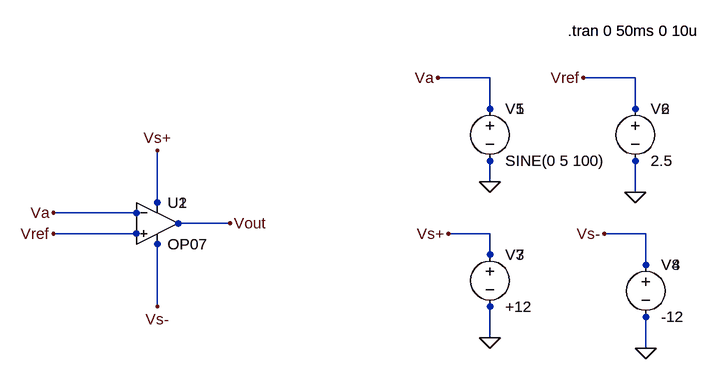
[diagram p0: schematic Draft2.asc]
Draft2.asc, the LTspice schematic file:
Version 4
SHEET 1 1096 680
WIRE 752 -80 672 -80
WIRE 976 -80 896 -80
WIRE 752 -32 752 -80
WIRE 976 -32 976 -80
WIRE 752 80 752 48
WIRE 976 96 976 48
WIRE 240 112 240 32
WIRE 208 128 80 128
WIRE 352 144 272 144
WIRE 208 160 80 160
WIRE 752 160 688 160
WIRE 992 160 928 160
WIRE 752 192 752 160
WIRE 992 208 992 160
WIRE 240 272 240 176
WIRE 752 320 752 272
WIRE 992 336 992 288
FLAG 672 -80 Va
FLAG 896 -80 Vref
FLAG 688 160 Vs+
FLAG 928 160 Vs-
FLAG 752 80 0
FLAG 976 96 0
FLAG 752 320 0
FLAG 992 336 0
FLAG 80 128 Va
FLAG 80 160 Vref
FLAG 240 32 Vs+
FLAG 240 272 Vs-
FLAG 352 144 Vout
SYMBOL voltage 752 -48 R0
WINDOW 123 0 0 Left 0
WINDOW 39 0 0 Left 0
SYMATTR InstName V1
SYMATTR Value SINE(0 5 100)
SYMBOL voltage 976 -48 R0
SYMATTR InstName V2
SYMATTR Value 2.5
SYMBOL voltage 752 176 R0
SYMATTR InstName V3
SYMATTR Value +12
SYMBOL voltage 992 192 R0
SYMATTR InstName V4
SYMATTR Value -12
SYMBOL OpAmps\\OP07 240 80 R0
SYMATTR InstName U1
SYMBOL voltage 752 -48 R0
WINDOW 123 0 0 Left 0
WINDOW 39 0 0 Left 0
SYMATTR InstName V5
SYMATTR Value SINE(0 5 100)
SYMBOL voltage 976 -48 R0
SYMATTR InstName V6
SYMATTR Value 2.5
SYMBOL voltage 752 176 R0
SYMATTR InstName V7
SYMATTR Value +12
SYMBOL voltage 992 192 R0
SYMATTR InstName V8
SYMATTR Value -12
SYMBOL OpAmps\\OP07 240 80 R0
SYMATTR InstName U2
TEXT 872 -152 Left 2 !.tran 0 50ms 0 10u
TEXT 872 -152 Left 2 !.tran 0 50ms 0 10u

The netlist it stands for:
* Draft2.asc
V1 Va 0 SINE(0 5 100)
V2 Vref 0 2.5
V3 Vs+ 0 +12
V4 Vs- 0 -12
XU1 Vref Va Vs+ Vs- Vout LT1001  ; OP07, pins In+ In- V+ V- OUT
V5 Va 0 SINE(0 5 100)
V6 Vref 0 2.5
V7 Vs+ 0 +12
V8 Vs- 0 -12
XU2 Vref Va Vs+ Vs- Vout LT1001  ; OP07, pins In+ In- V+ V- OUT
.tran 0 50ms 0 10u
.tran 0 50ms 0 10u
.lib LTC.lib
.backanno
.end

* Results of the author's LTspice run, read from the files saved beside the schematic
* Operating Point, zero values left out:
*   V(vref) = 2.5 V
*   V(vs+) = 12 V
*   V(vs-) = -12 V
*   V(vout) = 11.07 V
*   I(V4) = 2.254 mA
*   I(V3) = -2.247 mA
*   I(V2) = -869.6 µA
*   I(V1) = 869.6 µA
*   Ix(u1:1) = 869.6 µA
*   Ix(u1:2) = -869.6 µA
*   Ix(u1:3) = 2.247 mA
*   Ix(u1:4) = -2.254 mA
*   Ix(u1:5) = -22.14 pA
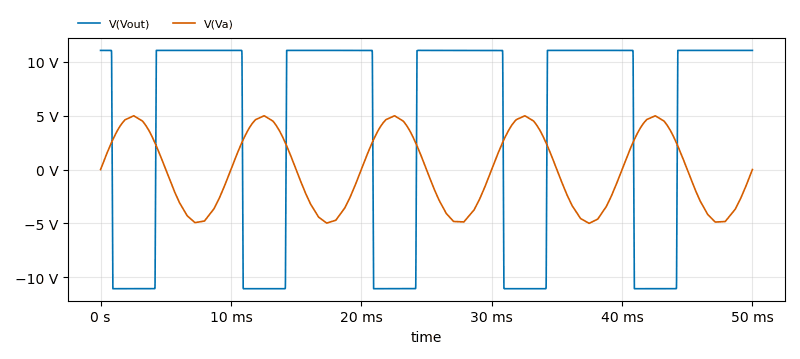
[diagram p1: Transient Analysis of Draft2.asc, plotted from the saved traces]
* Transient Analysis, 1 run:
*   V(Vout): min -11.08 V, max 11.08 V, average 3.69 V, rms 11.01 V, last 11.07 V
*   V(Va): min -4.999 V, max 4.997 V, average 10.51 mV, rms 3.509 V, last 0 V